# Altium schematic sheet GP8102STEST.SchDoc
size A4
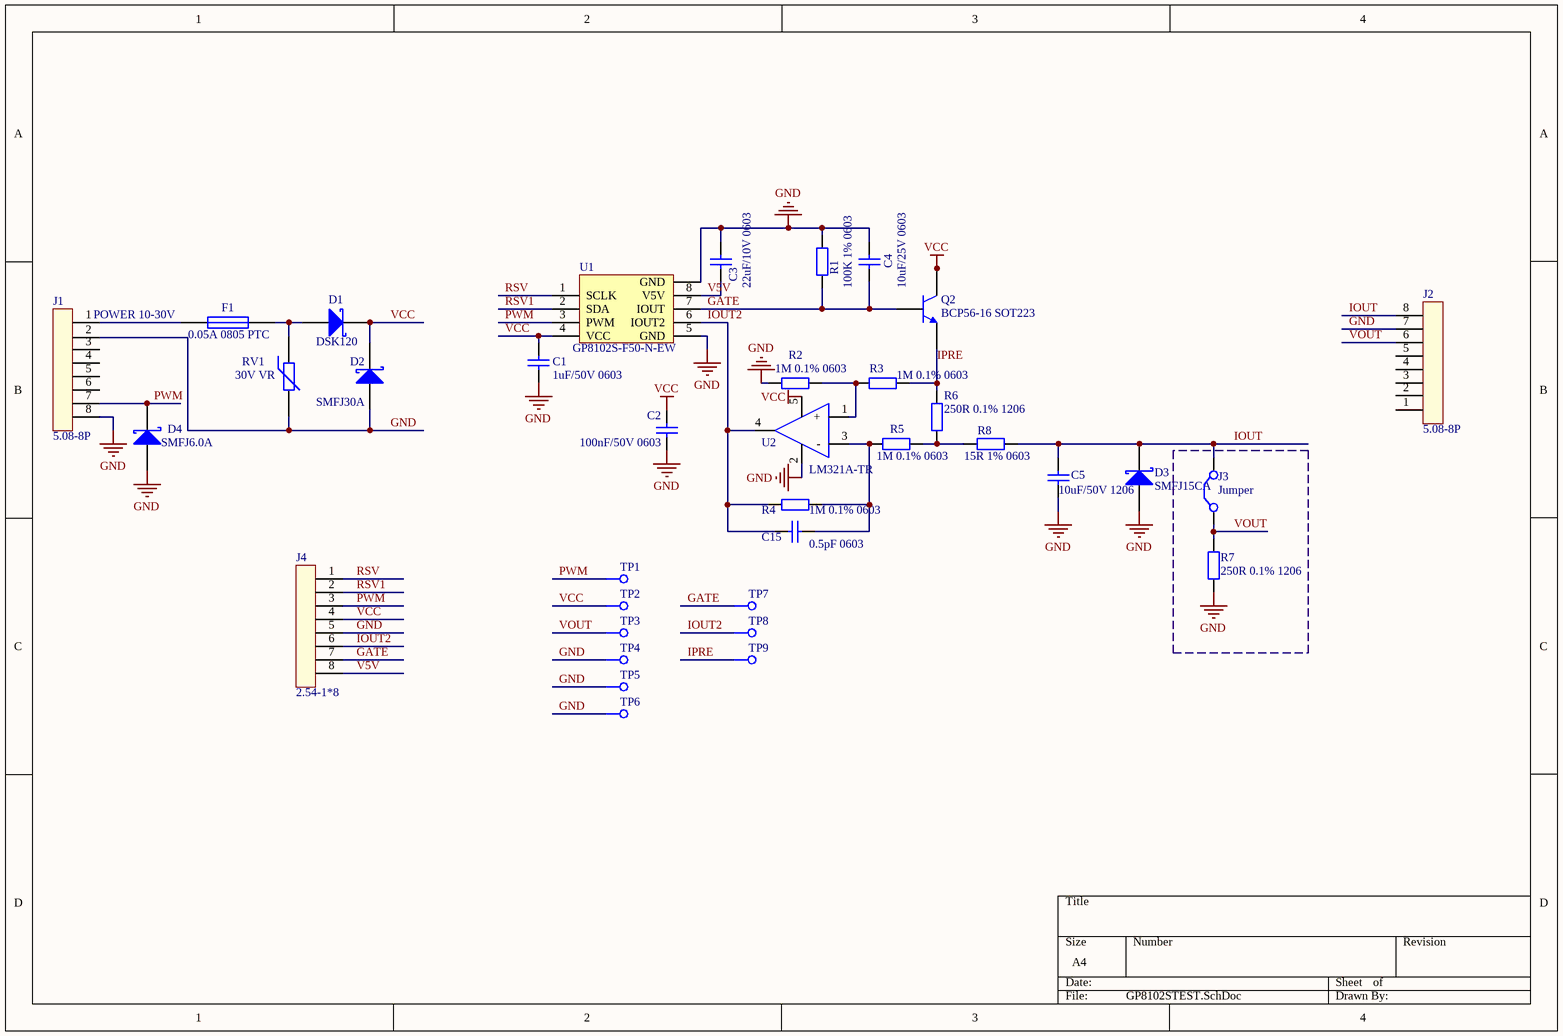
[diagram p0: GP8102STEST.SchDoc]

## Parts
C1  1uF/50V 0603  [CAP_0603]
C2  100nF/50V 0603  [CAP_0603]
C3  22uF/10V 0603  [CAP_0603]
C4  10uF/25V 0603  [CAP_0603]
C5  value 10uF/50V 1206  [CAP_1206]  (hidden comment: 10nF/50V 1206)
C15  0.5pF 0603  [CAP_0603]
D1  DSK120  [SODFL370X120-2N]
D2  SMFJ30A  [SODFL370X120-2N]
D3  SMFJ15CA  [SODFL370X120-2N]
D4  SMFJ6.0A  [SODFL370X120-2N]
F1  0.05A 0805 PTC  [RES_0805]  (value not drawn)
J1  5.08-8P  [5.08-8P]
J2  5.08-8P  [5.08-8P]
J3  Jumper  [2.54-1*2]
J4  2.54-1*8  [2.54-1*8]
Q2  BCP56-16 SOT223  [NPN_SOT223]
R1  100K 1% 0603  [RES_0603]
R2  value 1M 0.1% 0603  [RES_0603]  (hidden comment: 1M 0603)
R3  value 1M 0.1% 0603  [RES_0603]  (hidden comment: 1M 0603)
R4  value 1M 0.1% 0603  [RES_0603]  (hidden comment: 1M 0603)
R5  value 1M 0.1% 0603  [RES_0603]  (hidden comment: 1M 0603)
R6  250R 0.1% 1206  [RES_1206]
R7  250R 0.1% 1206  [RES_1206]
R8  value 15R 1% 0603  [RES_0603]  (hidden comment: 1M 0603)
RV1  30V VR  [RES_0805]
TP1  PWM  [Hole_Test]  (value not drawn)
TP2  VCC  [Hole_Test]  (value not drawn)
TP3  VOUT  [Hole_Test]  (value not drawn)
TP4  GND  [Hole_Test]  (value not drawn)
TP5  GND  [Hole_Test]  (value not drawn)
TP6  GND  [Hole_Test]  (value not drawn)
TP7  IOUT_7  [Hole_Test]  (value not drawn)
TP8  IOUT2  [Hole_Test]  (value not drawn)
TP9  IPRE  [Hole_Test]  (value not drawn)
U1  GP8102S-F50-N-EW  [ESOIC-8]
U2  LM321A-TR  [SOT23-5]

## Nets
GND: C1.2 C2.2 C3.2 C4.2 C5.1 D2.1(A) D3.1(A) D4.1(A) J1.2 J1.8 J2.7 J4.5 R1.1 R2.2 R7.1 RV1.2 TP4.1(SHell) TP5.1(SHell) TP6.1(SHell) U1.5(GND) U1.9(GND) U2.2(VS-)
VCC: C1.1 C2.1 D1.2(K) D2.2(K) J4.4 Q2.2 Q2.4 TP2.1(SHell) U1.4(VCC) U2.5(V+)
GATE: C4.1 J4.7 Q2.1 R1.2 TP7.1(SHell) U1.7(IOUT)
IOUT: C5.2 D3.2(K) J2.8 J3.2(C2) R8.2
IOUT2: C15.1 J4.6 R4.1 TP8.1(SHell) U1.6(IOUT2) U2.4(OUTA)
IPRE: Q2.3 R3.1 R6.2 TP9.1(SHell)
PWM: D4.2(K) J1.7 J4.3 TP1.1(SHell) U1.3(PWM)
RSV: J4.1 U1.1(SCLK)
RSV1: J4.2 U1.2(SDA)
V5V: C3.1 J4.8 U1.8(V5V)
VOUT: J2.6 J3.1(C1) R7.2 TP3.1(SHell)
NetC15_2: C15.2 R4.2 R5.2 U2.3(-)
NetD1_1: D1.1(A) F1.2 RV1.1
NetF1_1: F1.1 J1.1
NetR2_1: R2.1 R3.2 U2.1(+)
NetR5_1: R5.1 R6.1 R8.1

Not connected (* = marked no-connect by the designer): J1 3 4 5 6; J2 1 2 3 4 5

## Notes on the sheet
- (near J1) POWER 10-30V
- (near F1) 0.05A 0805 PTC

## Library data of the parts
C1-C4 = Cap: Published: 8-Jun-2000; LatestRevisionDate: 17-Jul-2002; LatestRevisionNote: Re-released for DXP Platform.; PackageReference: RAD-0.3; Publisher: Altium Limited; PackageDescription: Radial Cap, Thru-Hole; 2 Leads; 0.3 in Pin Spacing
  C1: Value: 1uF/50V 0603
  C2: Value: 100nF/50V 0603
  C3: Value: 22uF/10V 0603
C5 = Cap: 10uF/50V 1206; Published: 8-Jun-2000; LatestRevisionDate: 17-Jul-2002; LatestRevisionNote: Re-released for DXP Platform.; PackageReference: RAD-0.3; Publisher: Altium Limited; PackageDescription: Radial Cap, Thru-Hole; 2 Leads; 0.3 in Pin Spacing
C15 = Cap: 1pF 0603; Published: 8-Jun-2000; LatestRevisionDate: 17-Jul-2002; LatestRevisionNote: Re-released for DXP Platform.; PackageReference: RAD-0.3; Publisher: Altium Limited; PackageDescription: Radial Cap, Thru-Hole; 2 Leads; 0.3 in Pin Spacing; Value: 0.5pF 0603
D1-D4 = D Schottky: Published: 8-Jun-2000; LatestRevisionDate: 17-Jul-2002; LatestRevisionNote: Re-released for DXP Platform.; PackageReference: SMB; Publisher: Altium Limited; PackageDescription: DO-214-AA/SMB; 2 C-Bend Leads; Body 5.3 x 3.6 mm, inc. leads (LxW); Code_JEDEC: DO-214-AA
F1 = Fuse 1: Published: 8-Jun-2000; LatestRevisionDate: 17-Jul-2002; LatestRevisionNote: Re-released for DXP Platform.; PackageReference: PIN-W2/E2.8; Publisher: Altium Limited; PackageDescription: Thru-Hole; 2 Leads
J3 = Jumper: Jumper Wire; Published: 24-Mar-1999; LatestRevisionDate: 17-Jul-2002; LatestRevisionNote: Re-released for DXP Platform.; PackageReference: RAD-0.2; Publisher: Altium Limited; PackageDescription: Radial Cap, Thru-Hole; 2 Leads; 0.2 in Pin Spacing
J4 = 5.08-8P
Q2 = NPN_SOT223
R1-R8 = Res2: Published: 8-Jun-2000; LatestRevisionDate: 17-Jul-2002; LatestRevisionNote: Re-released for DXP Platform.; PackageReference: AXIAL-0.4; Publisher: Altium Limited; PackageDescription: Axial Device, Thru-Hole; 2 Leads; 0.4 in Pin Spacing
  R1: Value: 100K 1% 0603
  R6 R7: Value: 250R 0.1% 1206
RV1 = Res Varistor: Published: 24-Mar-1999; LatestRevisionDate: 29-May-2009; LatestRevisionNote: IPC-7351 Footprint Added.; PackageVersion: Mar-2003; PackageReference: 6-0805; Publisher: Altium Limited; PackageDescription: Chip Resistor 0805 Case Size; Code_IPC: RESC2012
TP1-TP9 = Hole: TP
U1 = GP810x
U2 = LM321: LM321 SOT23-5